# Altium project servo_board.PrjPcb
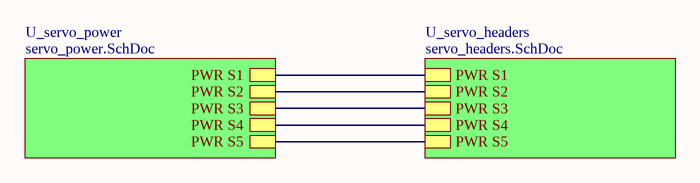
[diagram p0: servo_board.SchDoc]
3 sheets, 18 parts. Net scope: hierarchical (ports join the sheet entries above them; power ports are global).
Board file: servo_board.PcbDoc
Sheets:
  servo_board.SchDoc
    U_servo_headers = servo_headers.SchDoc
    U_servo_power = servo_power.SchDoc

## Sheet servo_board.SchDoc
size A4

### Sub-sheets
U_servo_headers = servo_headers.SchDoc: PWR S1, PWR S2, PWR S3, PWR S4, PWR S5
U_servo_power = servo_power.SchDoc: PWR S1, PWR S2, PWR S3, PWR S4, PWR S5

### Nets
NetC2_2: sheet U_servo_headers/PWR S1, sheet U_servo_power/PWR S1
NetC3_2: sheet U_servo_headers/PWR S2, sheet U_servo_power/PWR S2
NetC4_2: sheet U_servo_headers/PWR S3, sheet U_servo_power/PWR S3
NetC5_2: sheet U_servo_headers/PWR S4, sheet U_servo_power/PWR S4
NetC6_2: sheet U_servo_headers/PWR S5, sheet U_servo_power/PWR S5

## Sheet servo_headers.SchDoc
size A4
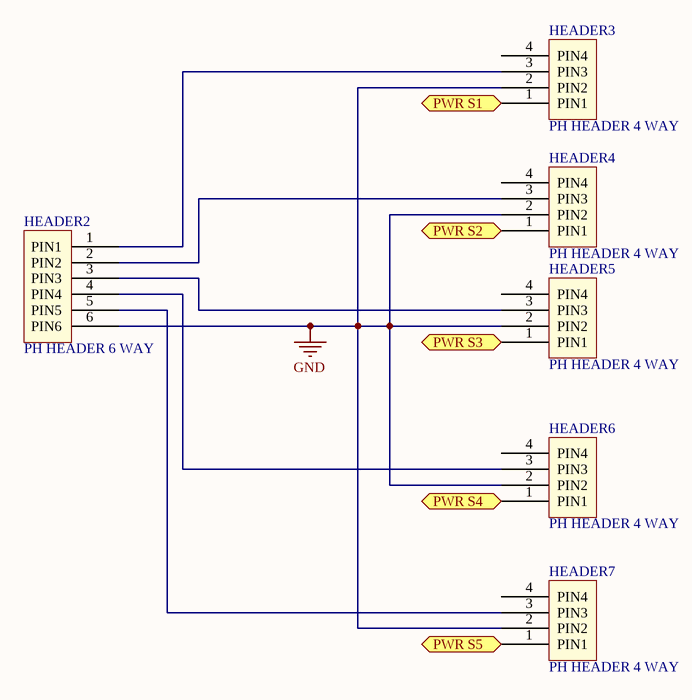
[diagram p1: servo_headers.SchDoc]

### Parts
HEADER2  PH HEADER 6 WAY  [PH CONNECTOR 6 WAY]
HEADER3  PH HEADER 4 WAY  [PH_HEADER 4WAY]
HEADER4  PH HEADER 4 WAY  [PH_HEADER 4WAY]
HEADER5  PH HEADER 4 WAY  [PH_HEADER 4WAY]
HEADER6  PH HEADER 4 WAY  [PH_HEADER 4WAY]
HEADER7  PH HEADER 4 WAY  [PH_HEADER 4WAY]

### Ports
PWR S1, PWR S2, PWR S3, PWR S4, PWR S5

### Nets
GND: HEADER2.6(PIN6) HEADER3.2(PIN2) HEADER4.2(PIN2) HEADER5.2(PIN2) HEADER6.2(PIN2) HEADER7.2(PIN2)
NetC2_2: HEADER3.1(PIN1) ; port PWR S1
NetC3_2: HEADER4.1(PIN1) ; port PWR S2
NetC4_2: HEADER5.1(PIN1) ; port PWR S3
NetC5_2: HEADER6.1(PIN1) ; port PWR S4
NetC6_2: HEADER7.1(PIN1) ; port PWR S5
NetHEADER2_1: HEADER2.1(PIN1) HEADER3.3(PIN3)
NetHEADER2_2: HEADER2.2(PIN2) HEADER4.3(PIN3)
NetHEADER2_3: HEADER2.3(PIN3) HEADER5.3(PIN3)
NetHEADER2_4: HEADER2.4(PIN4) HEADER6.3(PIN3)
NetHEADER2_5: HEADER2.5(PIN5) HEADER7.3(PIN3)

Not connected (* = marked no-connect by the designer): HEADER3 4(PIN4); HEADER4 4(PIN4); HEADER5 4(PIN4); HEADER6 4(PIN4); HEADER7 4(PIN4)

## Sheet servo_power.SchDoc
size A4
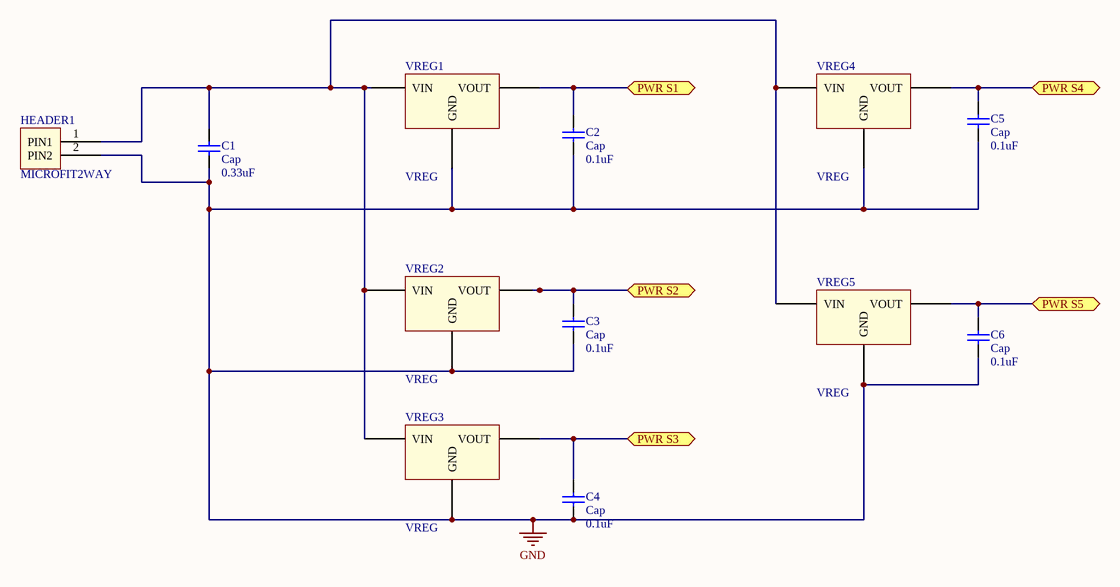
[diagram p2: servo_power.SchDoc]

### Parts
C1  Cap  value 0.33uF  [RAD-0.3]
C2  Cap  value 0.1uF  [RAD-0.3]
C3  Cap  value 0.1uF  [RAD-0.3]
C4  Cap  value 0.1uF  [RAD-0.3]
C5  Cap  value 0.1uF  [RAD-0.3]
C6  Cap  value 0.1uF  [RAD-0.3]
HEADER1  MICROFIT2WAY  [MICROFIT2WAY]
VREG1  VREG  [TO-220 VREG]
VREG2  VREG  [TO-220 VREG]
VREG3  VREG  [TO-220 VREG]
VREG4  VREG  [TO-220 VREG]
VREG5  VREG  [TO-220 VREG]

### Ports
PWR S1, PWR S2, PWR S3, PWR S4, PWR S5

### Nets
GND: C1.1 C2.1 C3.1 C4.1 C5.1 C6.1 HEADER1.2(PIN2) VREG1.2(GND) VREG2.2(GND) VREG3.2(GND) VREG4.2(GND) VREG5.2(GND)
NetC1_2: C1.2 HEADER1.1(PIN1) VREG1.1(VIN) VREG2.1(VIN) VREG3.1(VIN) VREG4.1(VIN) VREG5.1(VIN)
NetC2_2: C2.2 VREG1.3(VOUT) ; port PWR S1
NetC3_2: C3.2 VREG2.3(VOUT) ; port PWR S2
NetC4_2: C4.2 VREG3.3(VOUT) ; port PWR S3
NetC5_2: C5.2 VREG4.3(VOUT) ; port PWR S4
NetC6_2: C6.2 VREG5.3(VOUT) ; port PWR S5

### Library data of the parts
C1-C6 = Cap: Capacitor; Published: 8-Jun-2000; LatestRevisionDate: 17-Jul-2002; LatestRevisionNote: Re-released for DXP Platform.; PackageReference: RAD-0.3; Publisher: Altium Limited; PackageDescription: Radial Cap, Thru-Hole; 2 Leads; 0.3 in Pin Spacing
HEADER1 = MICROFIT2WAY HEADER
VREG1-VREG5 = VOLTAGE REGULATOR

## Nets that join several sheets
GND: servo_headers (6 pins), servo_power (12 pins)
NetC2_2: servo_headers (HEADER3.1), servo_power (C2.2 VREG1.3)
NetC3_2: servo_headers (HEADER4.1), servo_power (C3.2 VREG2.3)
NetC4_2: servo_headers (HEADER5.1), servo_power (C4.2 VREG3.3)
NetC5_2: servo_headers (HEADER6.1), servo_power (C5.2 VREG4.3)
NetC6_2: servo_headers (HEADER7.1), servo_power (C6.2 VREG5.3)